# Altium schematic sheet Buck-to-5V.SchDoc
size 292 x 193 mm; Author: Power Lin; SheetNumber: 1; SheetTotal: 1; Website: wiki-power.com
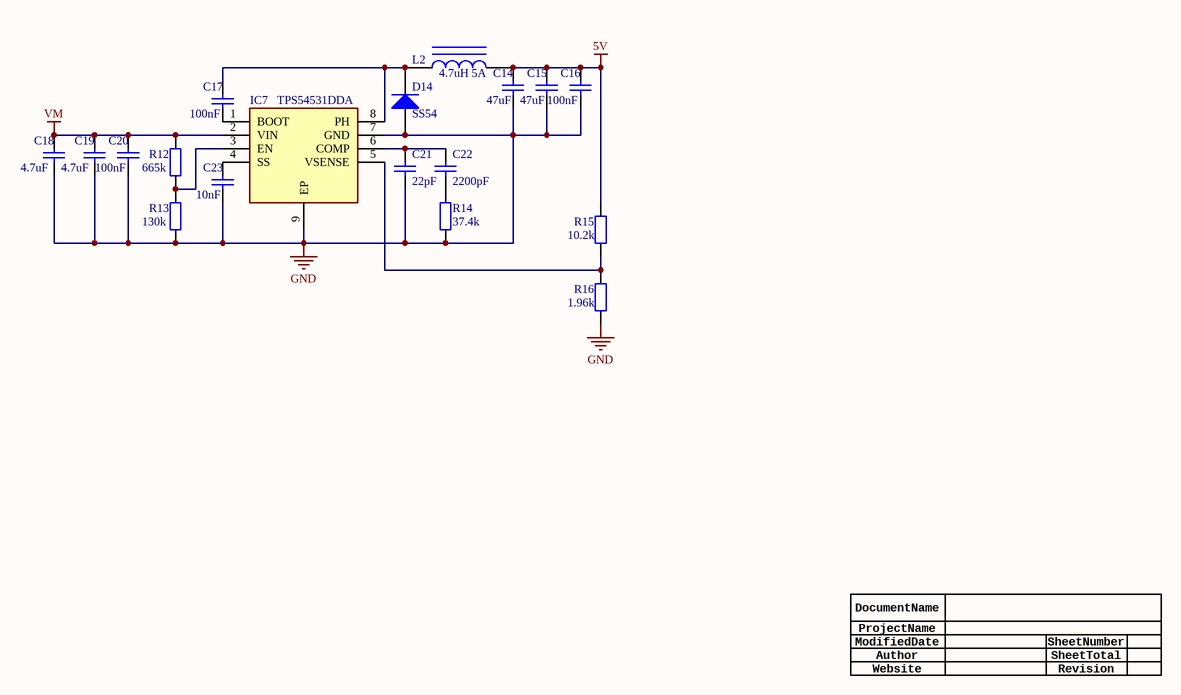
[diagram p0: Buck-to-5V.SchDoc]

## Parts
C14  47uF  [CAP-0603]
C15  47uF  [CAP-0603]
C16  100nF  [CAP-0603]
C17  100nF  [CAP-0603]
C18  4.7uF  [CAP-0603]
C19  4.7uF  [CAP-0603]
C20  100nF  [CAP-0603]
C21  22pF  [CAP-0603]
C22  2200pF  [CAP-0603]
C23  10nF  [CAP-0603]
D14  SS54  [DO-214AA/SMB]
IC7  TPS54531DDA  [SOIC_8_PAD]
L2  4.7uH 5A  [L-10040]
R12  665k  [R-0603]
R13  130k  [R-0603]
R14  37.4k  [R-0603]
R15  10.2k  [R-0603]
R16  1.96k  [R-0603]

## Nets
5V: C14.2 C15.2 C16.2 L2.2 R15.2
GND: C14.1 C15.1 C16.1 C18.1 C19.1 C20.1 C21.1 C23.1 D14.1(A) IC7.7(GND) IC7.9(EP) R13.1 R14.1 R16.1
VM: C18.2 C19.2 C20.2 IC7.2(VIN) R12.2
NetC17_1: C17.1 IC7.1(BOOT)
NetC17_2: C17.2 D14.2(K) IC7.8(PH) L2.1
NetC21_2: C21.2 C22.2 IC7.6(COMP)
NetC22_1: C22.1 R14.2
NetC23_2: C23.2 IC7.4(SS)
NetIC7_3: IC7.3(EN) R12.1 R13.2
NetIC7_5: IC7.5(VSENSE) R15.1 R16.2

## Notes on the sheet
- Author
- DocumentName
- ModifiedDate
- ProjectName
- SheetNumber
- SheetTotal
- Website
- Revision

## Library data of the parts
C14-C23 = CAP: 贴片电容; ComponentLink1Description: 供应商链接; ComponentLink1URL: http://www.szlcsc.com/product/details_53938.html; Package: 0402; Supplier: LC; SuppliersPartNumber: C52923
D14 = DIODE: 肖特基二极管; ComponentLink1Description: 供应商链接; ComponentLink1URL: http://www.szlcsc.com/product/details_23178.html; Package: SMA(DO-214AC); Supplier: LC; SuppliersPartNumber: C22452
IC7 = TPS54531DDA: 集成稳压芯片; Manufacturer_Name: Texas Instruments; Datasheet Link: http://www.ti.com/lit/gpn/tps54531; Height: 1.7mm; Manufacturer_Part_Number: TPS54531DDA; Mouser Part Number: 595-TPS54531DDA; Mouser Price/Stock: https://www.mouser.co.uk/ProductDetail/Texas-Instruments/TPS54531DDA?qs=jA5Ki6243omoJVKISZs%2FBg%3D%3D; Arrow Part Number: TPS54531DDA; Arrow Price/Stock: https://www.arrow.com/en/products/tps54531dda/texas-instruments
L2 = INDUCTOR: 电感; ComponentLink1Description: 供应商链接; ComponentLink1URL: http://www.szlcsc.com/product/details_33003.html; Package: 0402; Supplier: LC; SuppliersPartNumber: C32041
R12-R16 = RES: 贴片电阻; Package: 0805; Supplier: LC; SuppliersPartNumber: C17798